# Altium schematic sheet DAC_Block.SchDoc
size A4; SheetNumber: 10; SheetTotal: 16
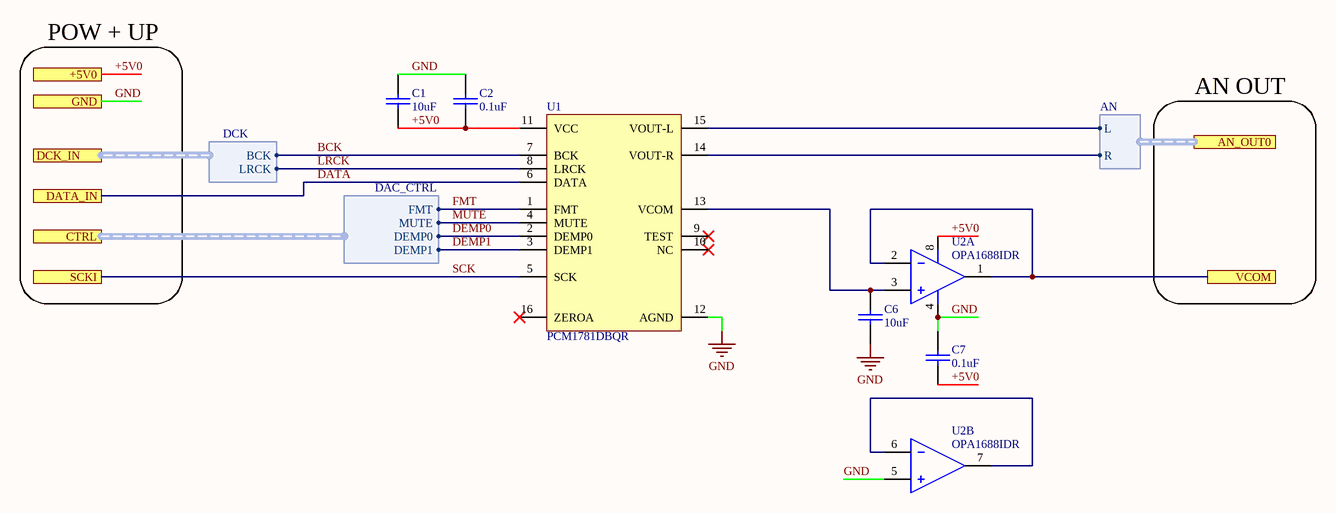
[diagram p0: DAC_Block.SchDoc]

## Parts
C1  10uF  [0603-CAP-TDK]
C2  0.1uF  [0402-CAP-TDK]
C6  10uF  [0603-CAP-TDK]
C7  0.1uF  [0402-CAP-TDK]
U1  PCM1781DBQR  [TI-SSOP-16 - DBQ0016A]
U2  OPA1688IDR  [TI-SOIC-8]  (parts A,B of 2)

## Ports
+5V0 (see DAC_Interface[2A], DAC_Interface[1A]), AN_OUT0 (harness AN, see DAC_Interface[3B], DAC_Interface[4B]), CTRL (harness DAC_CTRL, see DAC_Interface[2B], DAC_Interface[1C]), DATA_IN (see DAC_Interface[2B]), DCK_IN (harness DCK, see DAC_Interface[2B]), GND (see DAC_Interface[2B], DAC_Interface[1B]), SCKI (see DAC_Interface[2B]), VCOM (see DAC_Interface[3B])

## Harnesses
DCK: BCK, LRCK
AN: L, R
DAC_CTRL: FMT, MUTE, DEMP0, DEMP1

## Nets
GND: C1.1 C2.1 C6.1 C7.2 U1.12(AGND) U2.4(GND) U2.5(2IN+) ; port GND
+5V0: C1.2 C2.2 C7.1 U1.11(VCC) U2.8(VDD) ; port +5V0
BCK: U1.7(BCK) ; port DCK_IN.BCK
DATA: U1.6(DATA) ; port DATA_IN
DEMP0: U1.2(DEMP0) ; port CTRL.DEMP0
DEMP1: U1.3(DEMP1) ; port CTRL.DEMP1
FMT: U1.1(FMT) ; port CTRL.FMT
LRCK: U1.8(LRCK) ; port DCK_IN.LRCK
MUTE: U1.4(MUTE) ; port CTRL.MUTE
SCK: U1.5(SCK) ; port SCKI
VCOM: U2.1(1OUT) U2.2(1IN-) ; port VCOM
NetC6_2: C6.2 U1.13(VCOM) U2.3(1IN+)
NetU1_14: U1.14(VOUT-R) ; port AN_OUT0.R
NetU1_15: U1.15(VOUT-L) ; port AN_OUT0.L
NetU2_6: U2.6(2IN-) U2.7(2OUT)

Not connected (* = marked no-connect by the designer): U1 9(TEST)* 10(NC)* 16(ZEROA)*

## Notes on the sheet
- POW + UP
- AN OUT

## Library data of the parts
C1 C2 C6 C7 = CAP-SMD
  C1 C6: JLCPart: C96446
  C2 C7: JLCPart: C307331
U1 = PCM1781DBQR: DAC, Audio 24 b 192k DSP, I2S 16-SSOP; JLCPart: C2667281
U2 = OPA1688IDR: Rail-To-Rail Amplifier 2 Circuit - 8-SOIC; JLCPart: C206212